# Altium project RemoteKill.PrjPcb
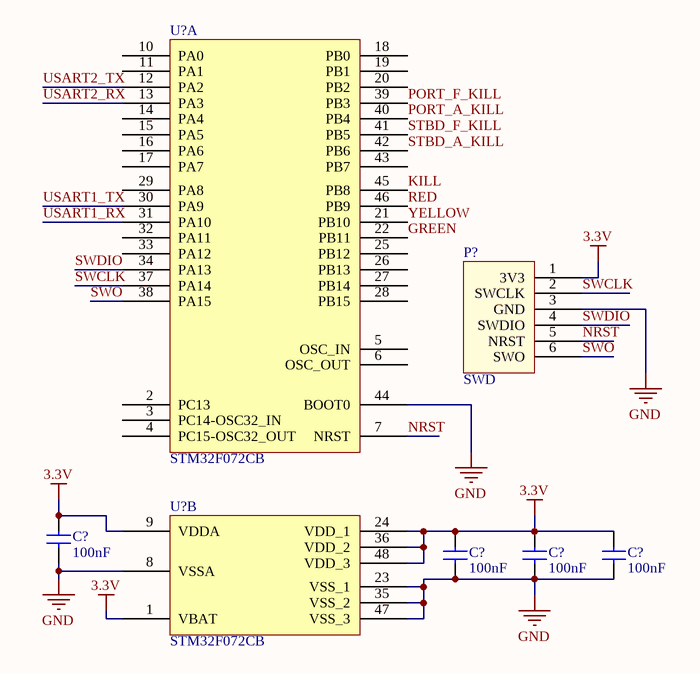
[diagram p0: RemoteKillTop.SchDoc]
3 sheets, 8 parts. Net scope: flat (ports and power ports of the same name join across sheets).
Board file: RemoteKill.PcbDoc
Sheets:
  RemoteKillTop.SchDoc
  Power.SchDoc
  Radio.SchDoc

## Sheet RemoteKillTop.SchDoc
size A

### Parts
(Parts that share a designator on the sheet are numbered #1, #2 ... from top to bottom, then left to right.)
C?#1  value 100nF  [CAPC0603]  (hidden comment: Cap)
C?#2  value 100nF  [CAPC0603]  (hidden comment: Cap)
C?#3  value 100nF  [CAPC0603]  (hidden comment: Cap)
C?#4  value 100nF  [CAPC0603]  (hidden comment: Cap)
P?  SWD  [SWD_STM32]
U?#1  STM32F072CB  [STM32F072CB]  (part A of 2)
U?#2  STM32F072CB  [STM32F072CB]  (part B of 2)

### Nets
3.3V: C?#1.1(A) C?#2.1(A) C?#3.1(A) C?#4.1(A) P?.1(3V3) U?#2.1(VBAT) U?#2.9(VDDA) U?#2.24(VDD_1) U?#2.36(VDD_2) U?#2.48(VDD_3)
GND: C?#1.2(B) C?#2.2(B) C?#3.2(B) C?#4.2(B) P?.3(GND) U?#1.44(BOOT0) U?#2.8(VSSA) U?#2.23(VSS_1) U?#2.35(VSS_2) U?#2.47(VSS_3)
GREEN: U?#1.22(PB11)
KILL: U?#1.45(PB8)
NRST: P?.5(NRST) U?#1.7(NRST)
PORT_A_KILL: U?#1.40(PB4)
PORT_F_KILL: U?#1.39(PB3)
RED: U?#1.46(PB9)
STBD_A_KILL: U?#1.42(PB6)
STBD_F_KILL: U?#1.41(PB5)
SWCLK: P?.2(SWCLK) U?#1.37(PA14)
SWDIO: P?.4(SWDIO) U?#1.34(PA13)
SWO: P?.6(SWO) U?#1.38(PA15)
USART1_RX: U?#1.31(PA10)
USART1_TX: U?#1.30(PA9)
USART2_RX: U?#1.13(PA3)
USART2_TX: U?#1.12(PA2)
YELLOW: U?#1.21(PB10)

Not connected (* = marked no-connect by the designer): U?#1 2(PC13) 3(PC14-OSC32_IN) 4(PC15-OSC32_OUT) 5(OSC_IN) 6(OSC_OUT) 10(PA0) 11(PA1) 14(PA4) 15(PA5) 16(PA6) 17(PA7) 18(PB0) 19(PB1) 20(PB2) 25(PB12) 26(PB13) 27(PB14) 28(PB15) 29(PA8) 32(PA11) 33(PA12) 43(PB7)

### Library data of the parts
P? = SWD_STM32: SWD connector matching the pinout on STM Discovery Boards
U?#1 U?#2 = STM32F072CB: MCU 32BIT 128KB FLASH 48LQFP; Supplier 1: Digi-Key; Supplier Part Number 1: 497-14645-ND
C?#1-C?#4 = Cap: Supplier 1: Digi-Key; Supplier Part Number 1: 1276-1000-1-ND

## Sheet Power.SchDoc
size A

## Sheet Radio.SchDoc
size A
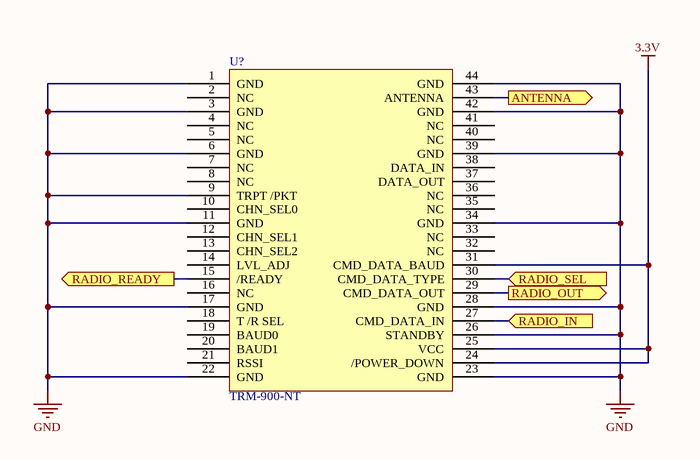
[diagram p1: Radio.SchDoc]

### Parts
(Parts that share a designator on the sheet are numbered #1, #2 ... from top to bottom, then left to right.)
U?#3  TRM-900-NT  [TRM-900-NT]

### Ports
ANTENNA (out), RADIO_IN (in), RADIO_OUT (out), RADIO_READY (out), RADIO_SEL (in)

### Nets
3.3V: U?#3.24(/POWER_DOWN) U?#3.25(VCC) U?#3.31(CMD_DATA_BAUD)
GND: U?#3.1(GND) U?#3.3(GND) U?#3.6(GND) U?#3.9(TRPT_/PKT) U?#3.11(GND) U?#3.17(GND) U?#3.22(GND) U?#3.23(GND) U?#3.26(STANDBY) U?#3.28(GND) U?#3.34(GND) U?#3.39(GND) U?#3.42(GND) U?#3.44(GND)
NetU?#3_15: U?#3.15(/READY) ; port RADIO_READY
NetU?#3_27: U?#3.27(CMD_DATA_IN) ; port RADIO_IN
NetU?#3_29: U?#3.29(CMD_DATA_OUT) ; port RADIO_OUT
NetU?#3_30: U?#3.30(CMD_DATA_TYPE) ; port RADIO_SEL
NetU?#3_43: U?#3.43(ANTENNA) ; port ANTENNA

Not connected (* = marked no-connect by the designer): U?#3 2(NC) 4(NC) 5(NC) 7(NC) 8(NC) 10(CHN_SEL0) 12(CHN_SEL1) 13(CHN_SEL2) 14(LVL_ADJ) 16(NC) 18(T_/R_SEL) 19(BAUD0) 20(BAUD1) 21(RSSI) 32(NC) 33(NC) 35(NC) 36(NC) 37(DATA_OUT) 38(DATA_IN) 40(NC) 41(NC)

### Library data of the parts
U?#3 = TRM-900-NT: RF TXRX MODULE ISM<1GHZ; Manufacturer: Linx; Supplier 1: Digi-Key; Supplier 1 Part Number: TRM-900-NT-ND; Manufacturer Part Number: TRM-900-NT

## Nets that join several sheets
3.3V: RemoteKillTop (10 pins), Radio (U?#3.24 U?#3.25 U?#3.31)
GND: RemoteKillTop (10 pins), Radio (14 pins)